# EAGLE schematic RasPi7021 (EAGLE 6.4)
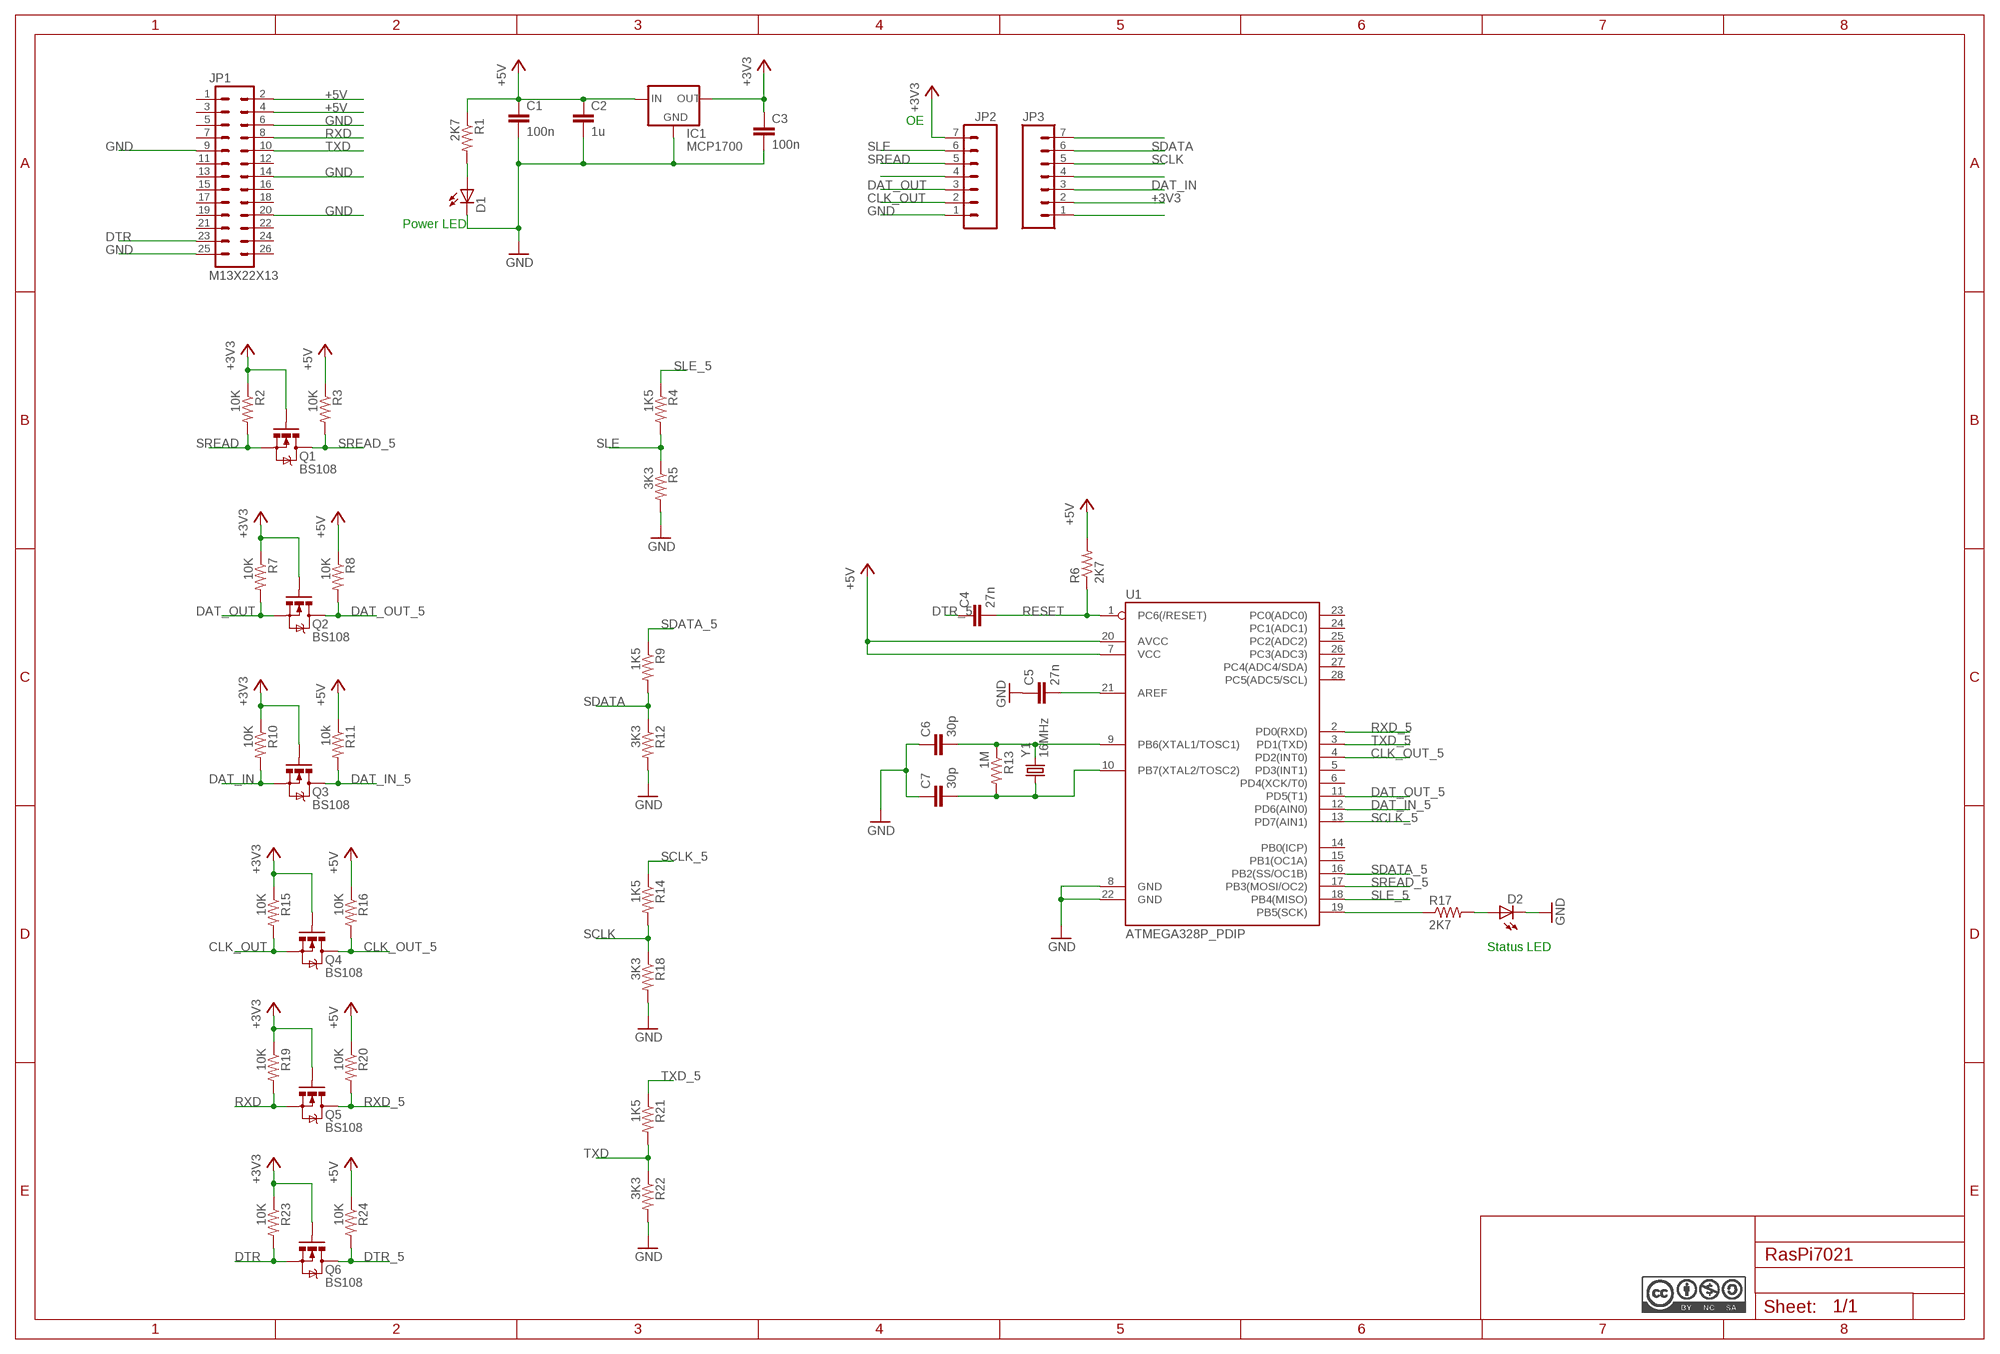
[diagram p0: schematic, sheet 1]

## Parts
C1  100n  CAPEZ  [CAP-PTH-SMALLEZ]
C2  1u  CAPEZ  [CAP-PTH-SMALLEZ]
C3  100n  CAPEZ  [CAP-PTH-SMALLEZ]
C4  27n  CAPEZ  [CAP-PTH-SMALLEZ]
C5  27n  CAPEZ  [CAP-PTH-SMALLEZ]
C6  30p  CAPEZ  [CAP-PTH-SMALLEZ]
C7  30p  CAPEZ  [CAP-PTH-SMALLEZ]
D1  LED3MM  [LED3MM]
D2  LED3MM  [LED3MM]
IC1  MCP1700  MCP1700INLINE  [TO92-INLINE]
JP1  M13X22X13  [2X13]
JP2  M07  [1X07]
JP3  M07  [1X07]
Q1  BS108  MOSFET-NCHANNELBS170  [TO-92]
Q2  BS108  MOSFET-NCHANNELBS170  [TO-92]
Q3  BS108  MOSFET-NCHANNELBS170  [TO-92]
Q4  BS108  MOSFET-NCHANNELBS170  [TO-92]
Q5  BS108  MOSFET-NCHANNELBS170  [TO-92]
Q6  BS108  MOSFET-NCHANNELBS170  [TO-92]
R1  2K7  RESISTOREZ  [AXIAL-0.3EZ]
R2  10K  RESISTOREZ  [AXIAL-0.3EZ]
R3  10K  RESISTOREZ  [AXIAL-0.3EZ]
R4  1K5  RESISTOREZ  [AXIAL-0.3EZ]
R5  3K3  RESISTOREZ  [AXIAL-0.3EZ]
R6  2K7  RESISTOREZ  [AXIAL-0.3EZ]
R7  10K  RESISTOREZ  [AXIAL-0.3EZ]
R8  10K  RESISTOREZ  [AXIAL-0.3EZ]
R9  1K5  RESISTOREZ  [AXIAL-0.3EZ]
R10  10K  RESISTOREZ  [AXIAL-0.3EZ]
R11  10k  RESISTOREZ  [AXIAL-0.3EZ]
R12  3K3  RESISTOREZ  [AXIAL-0.3EZ]
R13  1M  RESISTOREZ  [AXIAL-0.3EZ]
R14  1K5  RESISTOREZ  [AXIAL-0.3EZ]
R15  10K  RESISTOREZ  [AXIAL-0.3EZ]
R16  10K  RESISTOREZ  [AXIAL-0.3EZ]
R17  2K7  RESISTOREZ  [AXIAL-0.3EZ]
R18  3K3  RESISTOREZ  [AXIAL-0.3EZ]
R19  10K  RESISTOREZ  [AXIAL-0.3EZ]
R20  10K  RESISTOREZ  [AXIAL-0.3EZ]
R21  1K5  RESISTOREZ  [AXIAL-0.3EZ]
R22  3K3  RESISTOREZ  [AXIAL-0.3EZ]
R23  10K  RESISTOREZ  [AXIAL-0.3EZ]
R24  10K  RESISTOREZ  [AXIAL-0.3EZ]
U1  ATMEGA328P_PDIP  [DIL28-3]
Y1  16MHz  CRYSTAL_CRYSTALHC49S  [CRYSTAL_HC49/S]

## Nets
+3V3 [pwr]: C3.1 IC1.3(OUT) JP2.7 JP3.2 Q1.2(G) Q2.2(G) Q3.2(G) Q4.2(G) Q5.2(G) Q6.2(G) R2.P$1 R7.P$1 R10.P$1 R15.P$1 R19.P$1 R23.P$1
+5V [pwr]: C1.1 C2.1 IC1.2(IN) JP1.2 JP1.4 R1.P$1 R3.P$1 R6.P$2 R8.P$1 R11.P$1 R16.P$1 R20.P$1 R24.P$1 U1.7(VCC) U1.20(AVCC)
CLK_OUT: JP2.2 Q4.3(S) R15.P$2
CLK_OUT_5: Q4.1(D) R16.P$2 U1.4(PD2(INT0))
DAT_IN: JP3.3 Q3.3(S) R10.P$2
DAT_IN_5: Q3.1(D) R11.P$2 U1.12(PD6(AIN0))
DAT_OUT: JP2.3 Q2.3(S) R7.P$2
DAT_OUT_5: Q2.1(D) R8.P$2 U1.11(PD5(T1))
DTR: JP1.23 Q6.3(S) R23.P$2
DTR_5: C4.1 Q6.1(D) R24.P$2
GND [pwr]: C1.2 C2.2 C3.2 C5.1 C6.1 C7.1 D1.K(C) D2.K(C) IC1.1(GND) JP1.6 JP1.9 JP1.14 JP1.20 JP1.25 JP2.1 R5.P$2 R12.P$2 R18.P$2 R22.P$2 U1.8(GND) U1.22(GND)
N$1: R17.P$1 U1.19(PB5(SCK))
N$2: D1.A R1.P$2
N$3: D2.A R17.P$2
N$8: C7.2 R13.P$2 U1.10(PB7(XTAL2/TOSC2)) Y1.1
N$13: C6.2 R13.P$1 U1.9(PB6(XTAL1/TOSC1)) Y1.2
N$24: JP3.1
N$31: C5.2 U1.21(AREF)
N$33: JP3.4
N$36: JP3.7
N$40: JP2.4
RESET: C4.2 R6.P$1 U1.1(PC6(/RESET))
RXD: JP1.8 Q5.3(S) R19.P$2
RXD_5: Q5.1(D) R20.P$2 U1.2(PD0(RXD))
SCLK: JP3.5 R14.P$2 R18.P$1
SCLK_5: R14.P$1 U1.13(PD7(AIN1))
SDATA: JP3.6 R9.P$2 R12.P$1
SDATA_5: R9.P$1 U1.16(PB2(SS/OC1B))
SLE: JP2.6 R4.P$2 R5.P$1
SLE_5: R4.P$1 U1.18(PB4(MISO))
SREAD: JP2.5 Q1.3(S) R2.P$2
SREAD_5: Q1.1(D) R3.P$2 U1.17(PB3(MOSI/OC2))
TXD: JP1.10 R21.P$2 R22.P$1
TXD_5: R21.P$1 U1.3(PD1(TXD))
Unconnected: JP1.1 JP1.3 JP1.5 JP1.7 JP1.11 JP1.12 JP1.13 JP1.15 JP1.16 JP1.17 JP1.18 JP1.19 JP1.21 JP1.22 JP1.24 JP1.26 U1.5(PD3(INT1)) U1.6(PD4(XCK/T0)) U1.14(PB0(ICP)) U1.15(PB1(OC1A)) U1.23(PC0(ADC0)) U1.24(PC1(ADC1)) U1.25(PC2(ADC2)) U1.26(PC3(ADC3)) U1.27(PC4(ADC4/SDA)) U1.28(PC5(ADC5/SCL))

## Notes on the sheet
- OE
- Power LED
- Status LED

## Library data of the parts
C1-C7 = SparkFun-Capacitors:CAP: Capacitor Standard 0603 ceramic capacitor, and 0.1" leaded capacitor.
D1 D2 = SparkFun-LED:LED: LEDs Standard schematic elements and footprints for 5mm, 3mm, 1206, and 0603 sized LEDs. 5mm - Spark Fun Electronics SKU : COM-00529 (and others)
IC1 = adafruit:MCP1700: VOLTAGE REGULATOR
JP1 = SparkFun-Connectors:M13X2: 0.1" spaced headers
JP2 JP3 = SparkFun-Connectors:M07: Header 7 Standard 7-pin 0.1" header. Use with straight break away headers (SKU : PRT-00116), right angle break away headers (PRT-00553), swiss pins (PRT-00743), machine pins (PRT-00117), and female headers (PRT-00115). NOTES ON THE VARIANTS LOCK and LOCK_LONGPADS... This footprint was designed to help hold the alignment of a through-hole component (i.e. 7-pin header) while soldering it into place. You may notice that each hole has been shifted either up or down by 0.005 of an inch from it's more standard position (which is usually a perfectly straight line). This slight alteration caused the pins (the squares in the middle) to touch the edges of the holes. Because they are alternating, it causes a "brace" to hold the header in place. 0.005 has proven to be the perfect amount of "off-center" position when using our standard breakaway headers. Although looks a little odd when you look at the bare footprint, once you have a header in there, the alteration is very hard to notice. Also, if you push a header all the way into place, it is covered up entirely on the bottom side. This idea of altering the position of holes to aid alignment will be further integrated into the Sparkfun Library for other footprints. It can help hold any component with 3 or more connection pins.
Q1-Q6 = SparkFun-DiscreteSemi:MOSFET-NCHANNEL: Common NMOSFET Parts MFG P/N Store ID Prod ID FDD8780 TRANS-09984 SI7820DN TRANS-11055 FDS6630A IC-08089 2N7002PW TRANS-11151 FQP30N06L COM-10213 TRANS-10060 BSS123LT1G TRANS-08345 BSS138 TRANS-00830 BS170 2N7000
R1-R24 = SparkFun-Resistors:RESISTOR: Resistor Basic schematic elements and footprints for 0603, 1206, and PTH resistors.
U1 = SparkFun-DigitalIC:ATMEGA328P_PDIP: uC used in the Arduino 32kb flash, 1k EEPROM, 2k SRAM This is the through-hole version of this chip.
Y1 = AIS_Mk2:CRYSTAL_CRYSTAL: CRYSTAL

## Net classes
1 pwr: width 0.381 mm